# Altium schematic sheet UWB_Fuente-Cargador.SchDoc
size A4
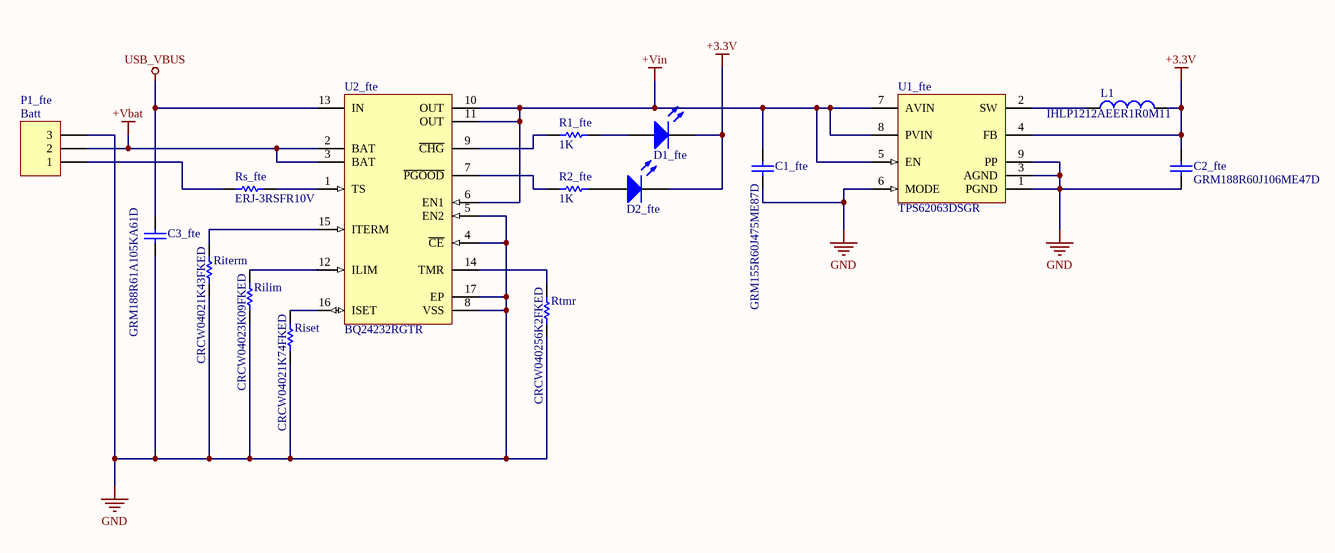
[diagram p0: UWB_Fuente-Cargador.SchDoc]

## Parts
C1_fte  value GRM155R60J475ME87D  [CAPC1005N]  (hidden comment: Cap)
C2_fte  value GRM188R60J106ME47D  [CAPC1608N]  (hidden comment: Cap)
C3_fte  value GRM188R61A105KA61D  [CAPC1608N]  (hidden comment: Cap)
D1_fte  LED  [LED SMD 0805]  (value not drawn)
D2_fte  LED  [LED SMD 0805]  (value not drawn)
L1  value IHLP1212AEER1R0M11  [IHLP-1212AE]  (hidden comment: Inductor)
P1_fte  Batt  [HDR1X3]
R1_fte  value 1K  [RESC1608N]  (hidden comment: Res1)
R2_fte  value 1K  [RESC1608N]  (hidden comment: Res1)
Rilim  value CRCW04023K09FKED  [RESC1005N]  (hidden comment: Res1)
Riset  value CRCW04021K74FKED  [RESC1005N]  (hidden comment: Res1)
Riterm  value CRCW04021K43FKED  [RESC1005N]  (hidden comment: Res1)
Rs_fte  value ERJ-3RSFR10V  [RESC1608N]  (hidden comment: Res1)
Rtmr  value CRCW040256K2FKED  [RESC1005N]  (hidden comment: Res1)
U1_fte  TPS62063DSGR  [DSG8-1600X900TP]
U2_fte  BQ24232RGTR  [RGT16-1700X1700TP]

## Nets
+3.3V: C2_fte.1 D1_fte.K D2_fte.K L1.1 U1_fte.4(FB)
+Vbat: P1_fte.2 U2_fte.2(BAT) U2_fte.3(BAT)
+Vin: C1_fte.1 U1_fte.5(EN) U1_fte.7(AVIN) U1_fte.8(PVIN) U2_fte.6(EN1) U2_fte.10(OUT) U2_fte.11(OUT)
GND: C1_fte.2 C2_fte.2 C3_fte.2 P1_fte.3 Rilim.1 Riset.1 Riterm.1 Rtmr.1 U1_fte.1(PGND) U1_fte.3(AGND) U1_fte.6(MODE) U1_fte.9(PP) U2_fte.4(~{CE}) U2_fte.5(EN2) U2_fte.8(VSS) U2_fte.17(EP)
USB_VBUS: C3_fte.1 U2_fte.13(IN)
NetD1_fte_A: D1_fte.A R1_fte.2
NetD2_fte_A: D2_fte.A R2_fte.2
NetL1_2: L1.2 U1_fte.2(SW)
NetP1_fte_1: P1_fte.1 Rs_fte.1
NetR1_fte_1: R1_fte.1 U2_fte.9(~{CHG})
NetR2_fte_1: R2_fte.1 U2_fte.7(~{PGOOD})
NetRilim_2: Rilim.2 U2_fte.12(ILIM)
NetRiset_2: Riset.2 U2_fte.16(ISET)
NetRiterm_2: Riterm.2 U2_fte.15(ITERM)
NetRs_fte_2: Rs_fte.2 U2_fte.1(TS)
NetRtmr_2: Rtmr.2 U2_fte.14(TMR)

## Library data of the parts
C1_fte C2_fte C3_fte = Cap: Capacitor; Published: 8-Jun-2000; LatestRevisionDate: 17-Jul-2002; LatestRevisionNote: Re-released for DXP Platform.; PackageReference: RAD-0.3; Publisher: Altium Limited
D1_fte D2_fte = LED: Typical INFRARED GaAs LED; Published: 8-Jun-2000; LatestRevisionDate: 08-Jul-2005; LatestRevisionNote: Mech Layer 1 removed.; Publisher: Altium Limited
L1 = Inductor: Code_IEC: 1005; Published: 8-Jun-2000; LatestRevisionDate: 17-Jul-2002; LatestRevisionNote: Re-released for DXP Platform.; PackageReference: 0402-A; Publisher: Altium Limited; Code_JEITA: 0402
P1_fte = Header 3: Header, 3-Pin MCU; LatestRevisionDate: 17-Jul-2002; LatestRevisionNote: Re-released for DXP Platform.; Publisher: Altium Limited
R1_fte R2_fte Rilim Riset Riterm Rs_fte Rtmr = Res1: Resistor; Published: 8-Jun-2000; LatestRevisionDate: 17-Jul-2002; LatestRevisionNote: Re-released for DXP Platform.; PackageReference: AXIAL-0.3; Publisher: Altium Limited
U1_fte = TPS62063DSGR: Buck Step Down Regulator with 2.7 to 6 V Input and 3.3 V Output, -40 to 85 degC, 8-Pin WSON (DSG), Green (RoHS & no Sb/Br); Manufacturer: Texas Instruments; Duty Cycle(Max)(%): 100; Iout(Max)(A): 1.6; Iq(Typ)(mA): 0.018; Preset Vout(V): 3.3; Rating: Catalog; Regulated Outputs(#): 1; SubFamily: Step-Down Regulator; Switch Current Limit(Typ)(A): 2.25; Synchronous Rectification: TRUE; Vin(Max)(V): 6; Vin(Min)(V): 2.7; DatasheetVersion: SLVSA95A; PackageVersion: revB, Oct-2010; PackageReference: DSG8-1600X900TP; PackageDescription: 8-Pin Plastic Small Outline No-Lead, 2 x 2 x 0.8 mm Body, 0.5 mm Pitch, Exposed Pad; Supplier 1: Digi-Key; Supplier Part Number 1: TPS62063DSGR-ND; Supplier 2: Mouser; Supplier Part Number 2: 595-TPS62063DSGR; Eco-Plan: Green (RoHS & no Sb/Br); Topology: Buck; Vout(Max)(V): 3.3; Vout(Min)(V): 3.3; Mounting Technology: Surface Mount; PartNumber: TPS62063DSGR; Code_JEDEC: MO-229; ComponentLink1Description: Datasheet; ComponentLink1URL: http://www.ti.com/general/docs/lit/getliterature.tsp?genericPartNumber=TPS62063&fileType=pdf; ComponentLink2Description: URL Link1; ComponentLink2URL: Samples URL:http://www.ti.com/product/tps62063#samples
U2_fte = BQ24232RGTR: USB Friendly 0.5 A Li+ Charger with Dynamic Power Management, 10.5 V OVP, 4.3 V, -40 to 85 degC, 16-pin QFN (RGT), Green (RoHS & no Sb/Br); Manufacturer: Texas Instruments; Lead Acid: N; SubFamily: Battery Charge Management; Vin(Min)(V): 4.3; DatasheetVersion: SLUS821C; PackageVersion: revH, Oct-2011; PackageReference: RGT16-1700X1700TP; PackageDescription: 16-Pin Plastic Quad Flat No-Lead, 3 x 3 mm Body, 0.5 mm Pitch, 1.7 x 1.7 mm Exposed Pad; Supplier 1: Digi-Key; Supplier Part Number 1: BQ24232RGTR-ND; Supplier 2: Mouser; Supplier Part Number 2: 595-BQ24232RGTR; Eco-Plan: Green (RoHS & no Sb/Br); Li-Ion: N; Li-Polymer: N; NiCd: N; NiMH: N; Over Voltage Protection: N; Mounting Technology: Surface Mount; PartNumber: BQ24232RGTR; Code_JEDEC: MO-220; ComponentLink1Description: Datasheet; ComponentLink1URL: http://www.ti.com/general/docs/lit/getliterature.tsp?genericPartNumber=BQ24232&fileType=pdf